# Altium schematic sheet IC310.schdoc
size 62 x 75 mm
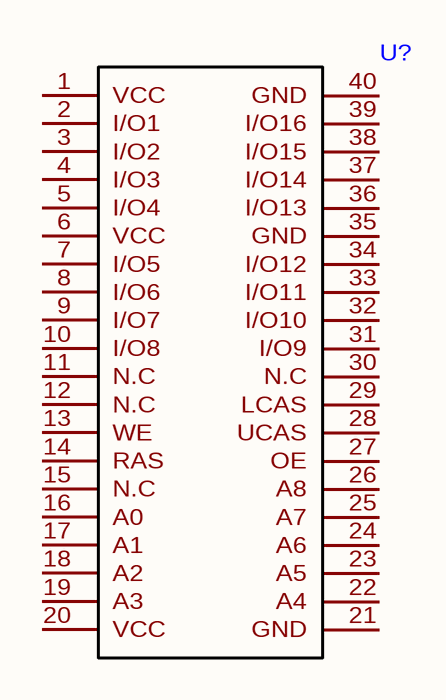
[diagram p0: IC310.schdoc]

## Parts
U?  (no value)  [SOJ-40_L25.8-W10.2-P1.27-LS11.2-BL]

## Nets

Not connected (* = marked no-connect by the designer): U? 1(VCC) 2(I/O1) 3(I/O2) 4(I/O3) 5(I/O4) 6(VCC) 7(I/O5) 8(I/O6) 9(I/O7) 10(I/O8) 11(N.C) 12(N.C) 13(WE) 14(RAS) 15(N.C) 16(A0) 17(A1) 18(A2) 19(A3) 20(VCC) 21(GND) 22(A4) 23(A5) 24(A6) 25(A7) 26(A8) 27(OE) 28(UCAS) 29(LCAS) 30(N.C) 31(I/O9) 32(I/O10) 33(I/O11) 34(I/O12) 35(GND) 36(I/O13) 37(I/O14) 38(I/O15) 39(I/O16) 40(GND)

## Library data of the parts
U? = IC310